# EasyEDA Pro project motoko_ice_dragon_x.eprj, board PCB1
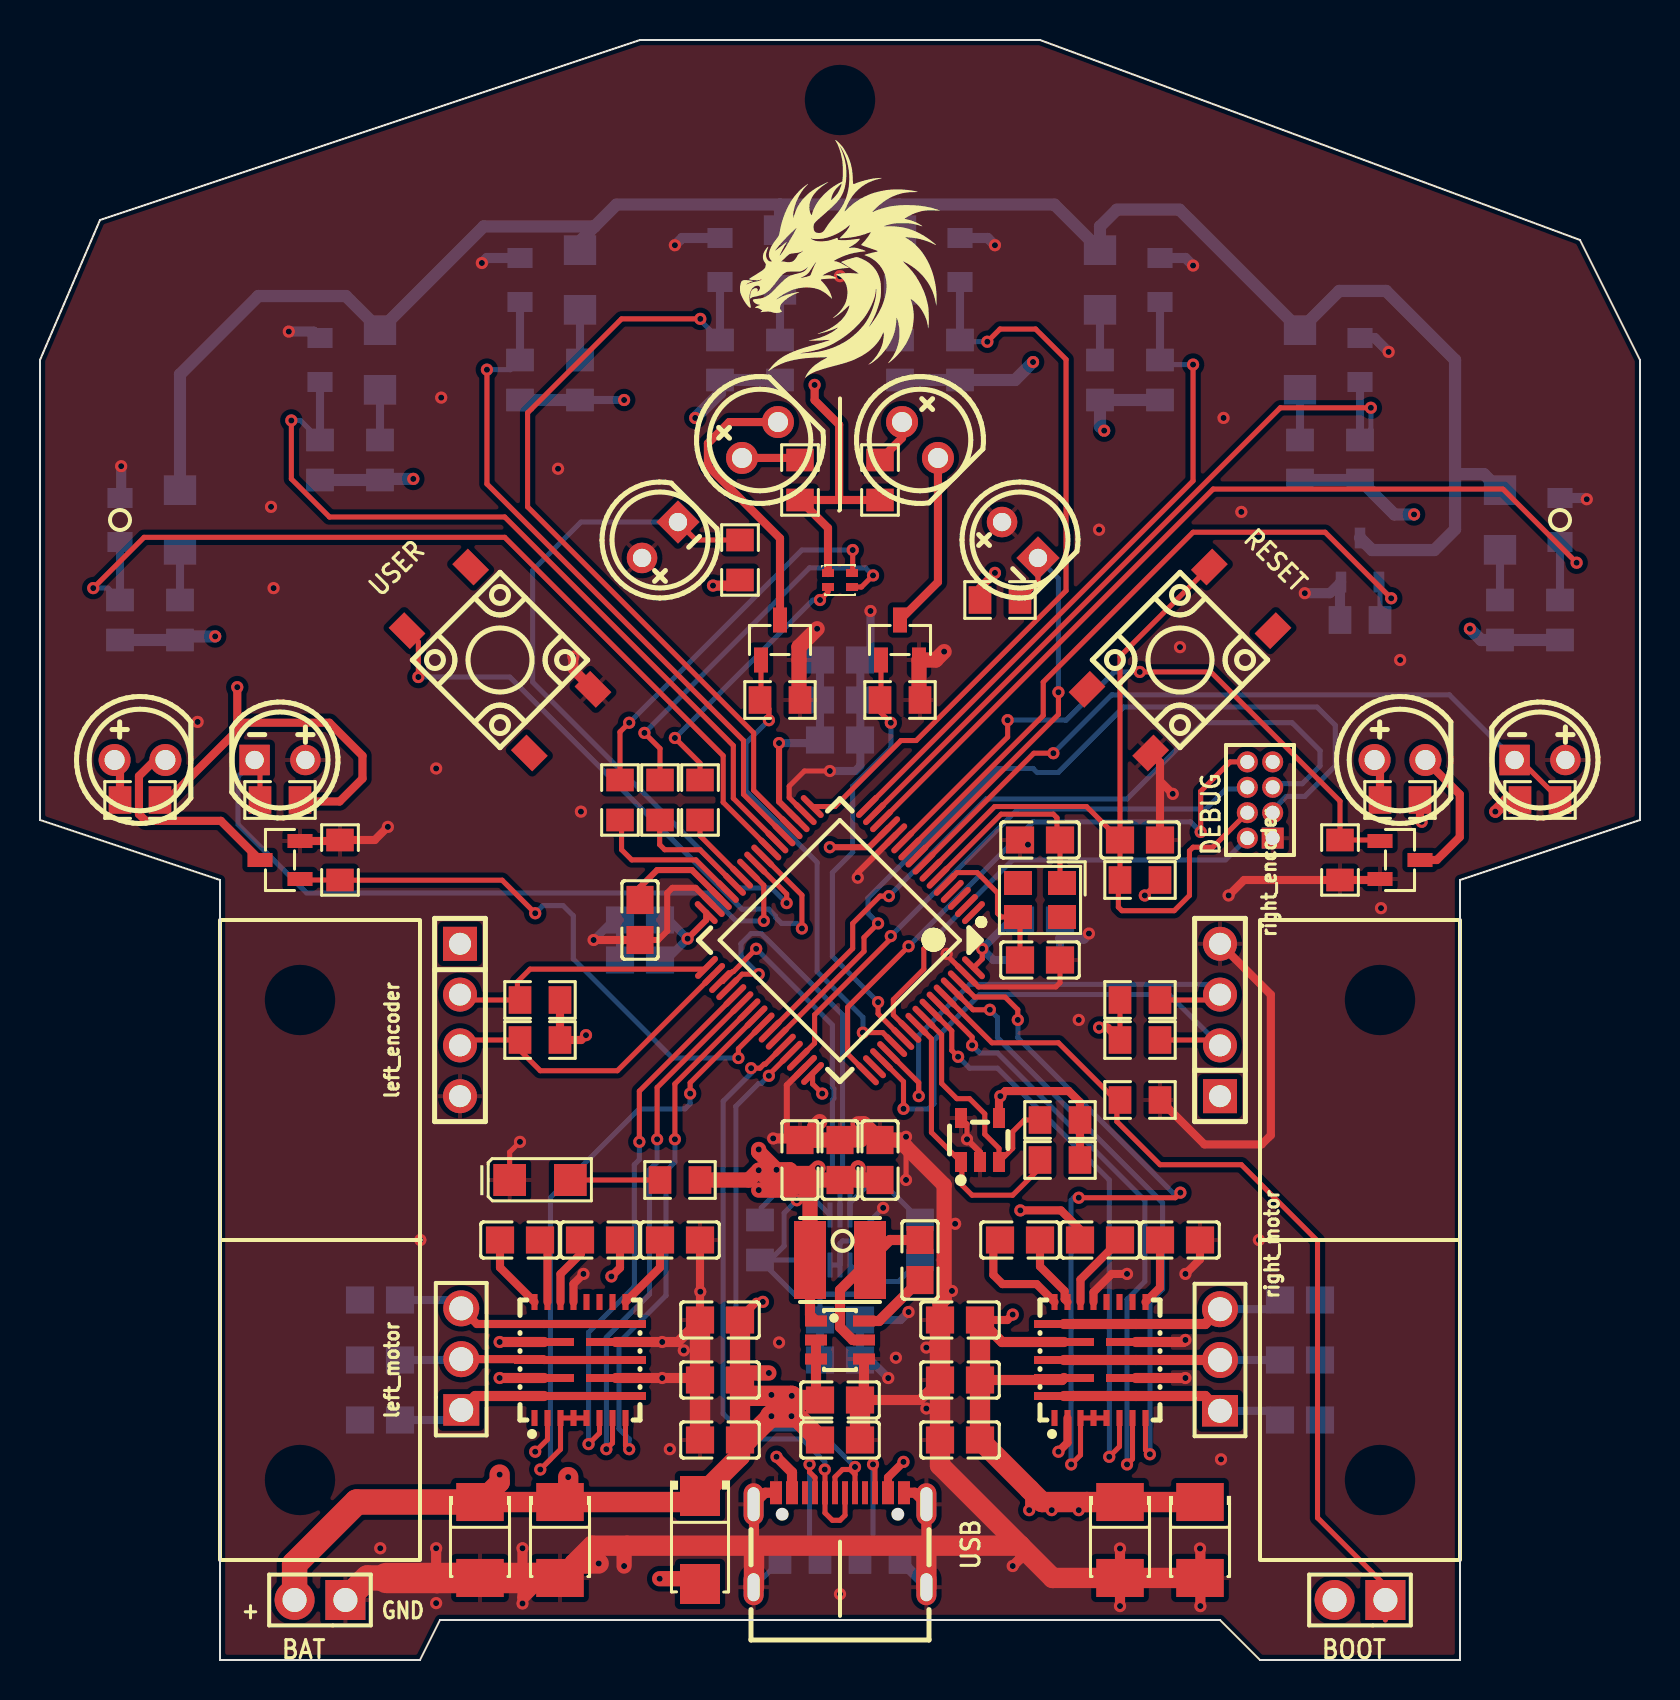
[diagram p4: board, top side]
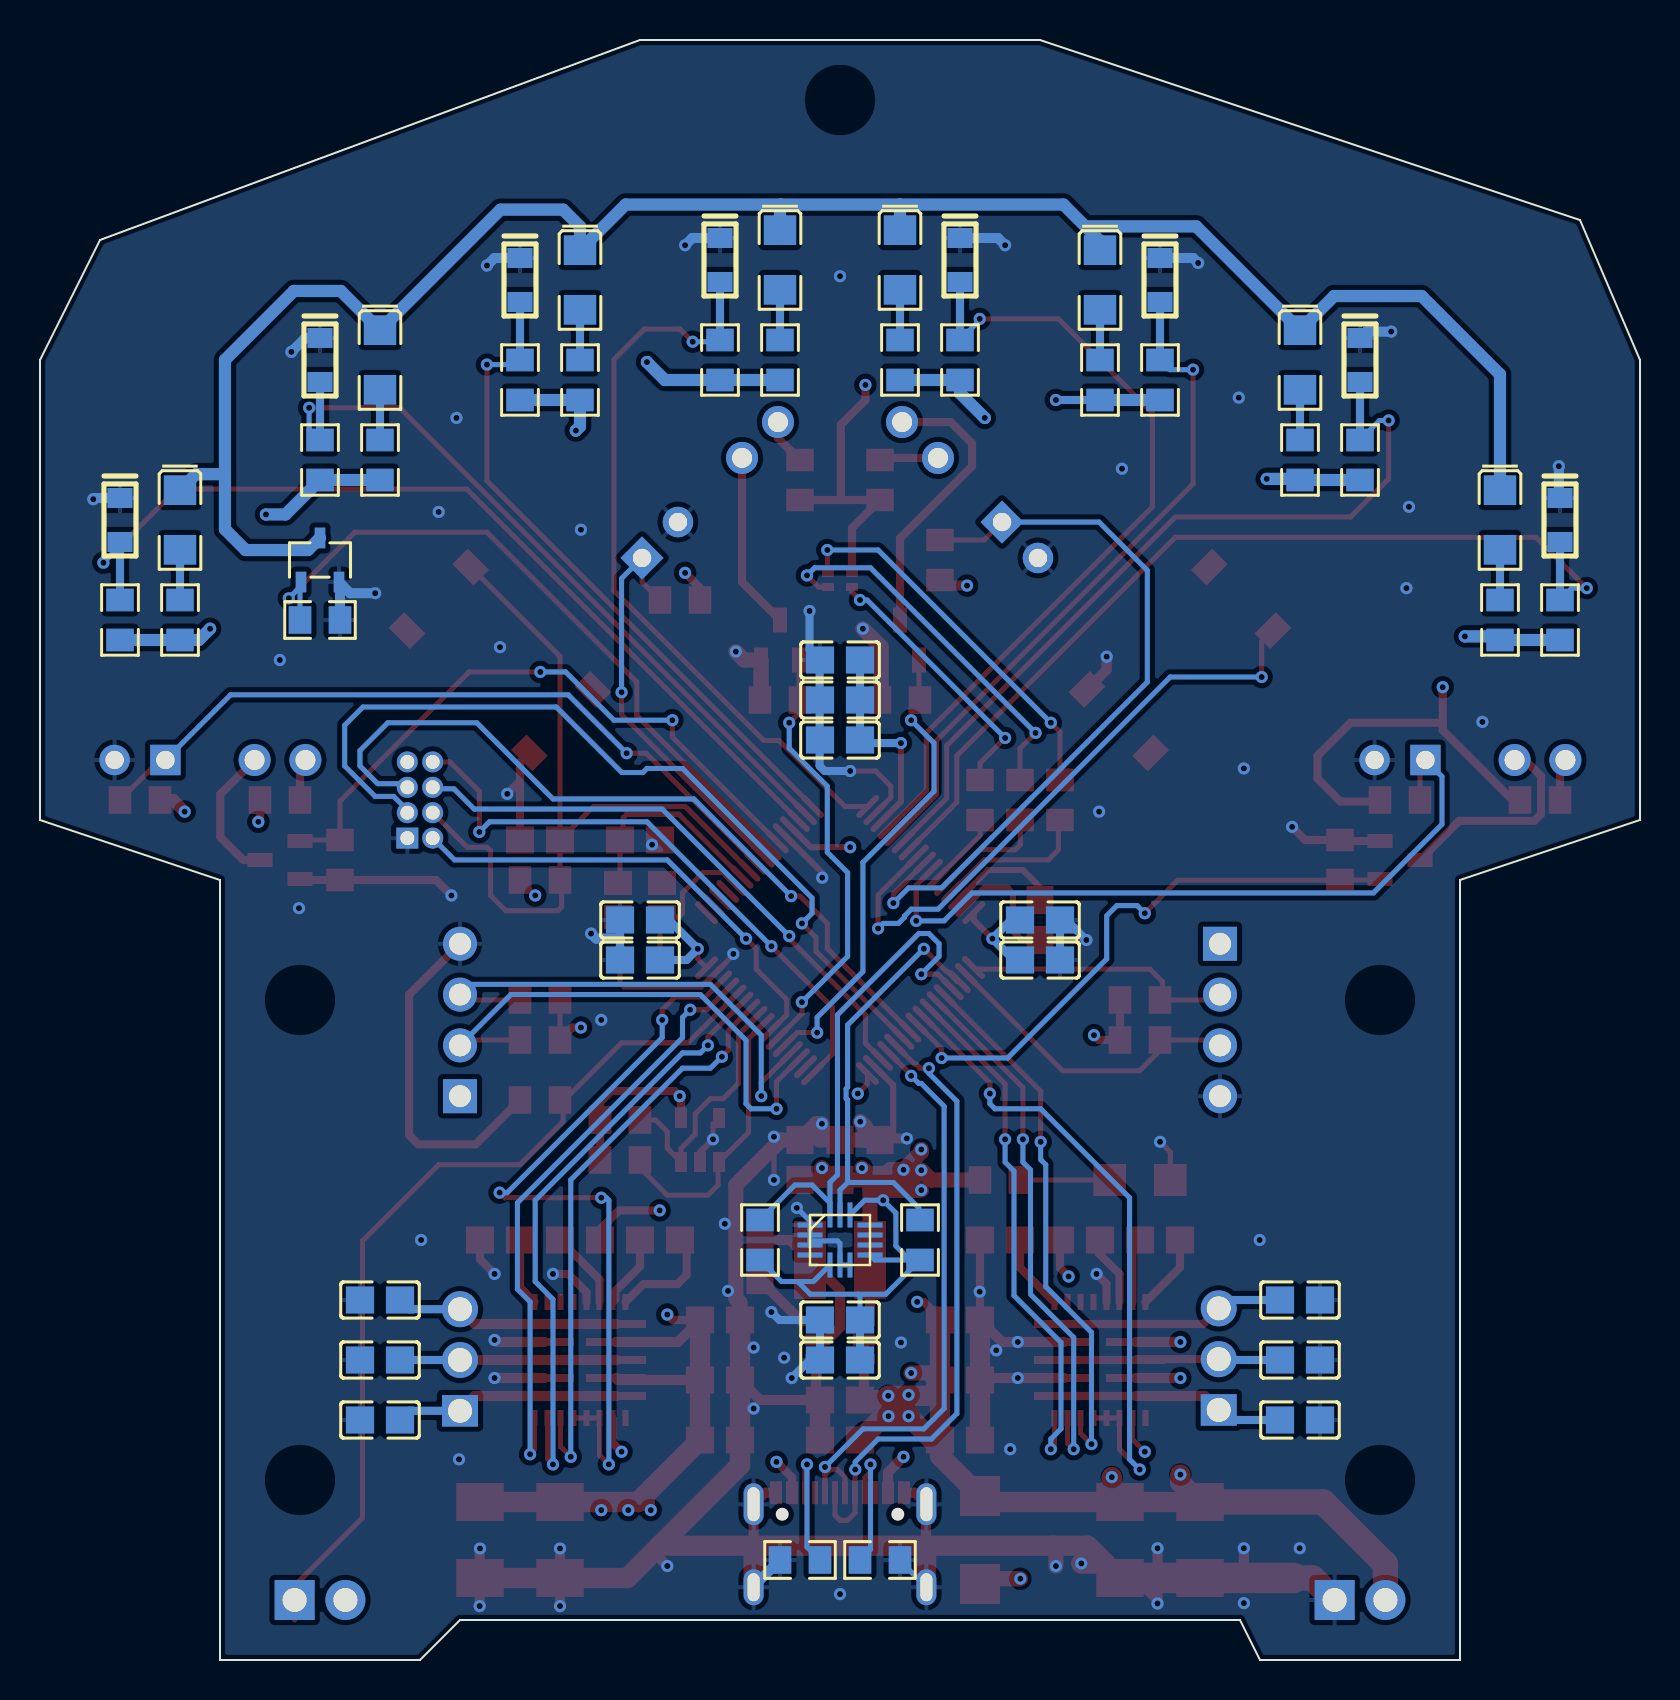
[diagram p5: board, bottom side, seen from below]

Outline 80 x 81 mm; copper layers: Top Layer, Inner1, Inner2, Bottom Layer. Coordinates in mm from the lower left corner of the outline.
Outline path: 0,65 0,42 9,39 9,0 19,0 20,2 59,2 61,0 71,0 71,39 80,42 80,65 77,71 50,81 30,81 3,72 0,65
Stack: Top Layer 0.035mm Outer layer thickness 1oz / Dielectric1 0.2104mm 7628 RC49% 8.6mil / Inner1 0.0152mm Inner layer thickness / Dielectric2 1.065mm 1.1mm H/HOZ Copper / Inner2 0.0152mm Inner layer thickness / Dielectric3 0.2104mm 7628 RC49% 8.6mil / Bottom Layer 0.035mm Outer layer thickness 1oz

## Design rules (mm)
template: JLCPCB Capability(Two Layers Board)
spacing copperThickness1oz (default): track to track 0.102, other pairs 0.152 to 0.3
spacing copperThickness2oz: track to track 0.203, other pairs 0.152 to 0.3
track width copperThickness1oz (default): min 0.127, default 0.254, max 2.54
track width copperThickness2oz: min 0.203, default 0.254, max 2.54
differential pair differentialPair (default): width min 0.127, default 0.254, max 2.54; gap min 0.152, default 0.152
via viaSize (default): diameter min 0.5, default 0.61, max 10; hole min 0.3, default 0.305, max 6.3

## Placement (name value [footprint] x y rotation side)
BAT  PZ254V-11-02P  [HDR-TH_2P-P2.54-V-M]  14 3 180 top
BOOT  PZ254V-11-02P  [HDR-TH_2P-P2.54-V-M]  66 3 180 top
C1  100nF  [C0805]  40 50 180 bottom
C2  100nF  [C0805]  40 46 180 bottom
C3  100nF  [C0805]  50 35 180 bottom
C4  100nF  [C0805]  30 35 0 bottom
C5  100nF  [C0805]  40 48 180 bottom
C6  10uF  [C0805]  50 37 180 bottom
C7  10uF  [C0805]  30 37 0 bottom
C8  2.2uF  [C0805]  30 37 270 top
C9  100nF  [C0805]  55 41 180 top
C11  100nF  [C0805]  34 11 0 top
C12  10uF  [C0805]  34 14 0 top
C13  100nF  [C0805]  24 21 0 top
C14  4.7uF  [C0805]  32 21 180 top
C15  1uF  [C0805]  28 21 180 top
C16  10uF  [C0805]  34 17 0 top
C17  100nF  [C0805]  46 17 0 top
C18  10uF  [C0805]  46 14 0 top
C19  100nF  [C0805]  49 21 0 top
C20  4.7uF  [C0805]  57 21 180 top
C21  1uF  [C0805]  53 21 0 top
C22  10uF  [C0805]  46 11 0 top
C62  100n  [C0805]  44 20 270 top
C63  100nF  [C0805]  40 25 270 top
C64  10uF  [C0805]  38 25 270 top
C65  10uF  [C0805]  42 25 270 top
C66  100nF  [C0805]  40 13 180 top
C67  10uF  [C0805]  40 11 180 top
C72  100nF  [C0805]  40 15 180 bottom
C73  100nF  [C0805]  40 17 180 bottom
C74  47uF  [CAP-SMD_L3.5-W2.8-R-RD]  26 6 90 top
C75  47uF  [CAP-SMD_L3.5-W2.8-R-RD]  22 6 90 top
C82  18p  [C0805]  50 35 180 top
C83  18p  [C0805]  50 41 0 top
C84  47uF  [CAP-SMD_L3.5-W2.8-R-RD]  54 6 90 top
C85  47uF  [CAP-SMD_L3.5-W2.8-R-RD]  58 6 90 top
C86  120p  [C0805]  17 12 0 bottom
C87  120p  [C0805]  17 15 0 bottom
C88  120p  [C0805]  17 18 0 bottom
C89  120p  [C0805]  63 12 180 bottom
C90  120p  [C0805]  63 15 180 bottom
C91  120p  [C0805]  63 18 180 bottom
D1  SS34  [SMA_L4.3-W2.6-LS5.2-RD]  33 6 270 top
DEBUG  PH-00742  [HDR-TH_8P-P1.27-V-M-R2-C4-S1.27]  61 43 90 top
L1  4.7uH  [IND-SMD_L4.0-W4.0_FNR40XXS]  40 20 180 top
LED1  CLMUD-FKC-CH1NP1561BB7T4S3  [LED-SMD_4P-L1.5-W1.5_CLMUD-FKC-CH1NP1561BB7T4S3]  40 54 0 top
LED2  YLED1206G  [LED1206-RD]  25 24 0 top
LED3  YLED1206W  [LED1206-R-RD]  73 57 270 bottom
LED4  YLED1206W  [LED1206-R-RD]  63 65 270 bottom
LED5  YLED1206W  [LED1206-R-RD]  53 69 270 bottom
LED6  YLED1206W  [LED1206-R-RD]  7 57 270 bottom
LED7  YLED1206W  [LED1206-R-RD]  37 70 270 bottom
LED8  YLED1206W  [LED1206-R-RD]  27 69 270 bottom
LED9  YLED1206W  [LED1206-R-RD]  43 70 270 bottom
LED10  YLED1206W  [LED1206-R-RD]  17 65 270 bottom
LED11  HSDL-4250  [LED-TH_BD5.0-P2.54-FD-1]  5 45 0 top
LED12  HSDL-4250  [LED-TH_BD5.0-P2.54-FD-1]  36 61 45 top
LED13  HSDL-4250  [LED-TH_BD5.0-P2.54-FD-1]  44 61 315 top
LED14  HSDL-4250  [LED-TH_BD5.0-P2.54-FD-1]  68 45 0 top
left_encoder  PZ254V-11-04P  [HDR-TH_4P-P2.54-V-M]  21 32 270 top
left_motor  2.54-1*3P针  [HDR-TH_3P-P2.54-V-M-1]  21.06 15.04 90 top
Q1  BSS123  [SOT-23-3_L3.0-W1.7-P0.95-LS2.9-BR]  66 55 270 bottom
Q2  BSS138  [SOT-23-3_L2.9-W1.3-P1.90-LS2.4-BR_1]  12 40 0 top
Q3  BSS138  [SOT-23-3_L2.9-W1.3-P1.90-LS2.4-BR_1]  37 51 270 top
Q4  BSS138  [SOT-23-3_L2.9-W1.3-P1.90-LS2.4-BR_1]  43 51 270 top
Q5  BSS138  [SOT-23-3_L2.9-W1.3-P1.90-LS2.4-BR_1]  68 40 180 top
R1  4.7kΩ  [R0805]  55 39 0 top
R2  4.7kΩ  [R0805]  55 28 0 top
R4  4.7kΩ  [R0805]  33 43 270 top
R5  4.7kΩ  [R0805]  31 43 270 top
R6  4.7kΩ  [R0805]  29 43 270 top
R7  4.7kΩ  [R0805]  25 33 0 top
R8  4.7kΩ  [R0805]  25 31 0 top
R9  4.7kΩ  [R0805]  55 31 180 top
R10  4.7kΩ  [R0805]  55 33 180 top
R11  4.7kΩ  [R0805]  44 21 270 bottom
R12  4.7kΩ  [R0805]  36 21 270 bottom
R13  4.7kΩ  [R0805]  66 52 0 bottom
R14  330Ω  [R0805]  73 52 270 bottom
R15  330Ω  [R0805]  63 60 270 bottom
R16  330Ω  [R0805]  53 64 270 bottom
R17  330Ω  [R0805]  7 52 270 bottom
R18  330Ω  [R0805]  37 65 270 bottom
R19  4.7kΩ  [R0805]  35 55 270 top
R20  4.7kΩ  [R0805]  48 53 180 top
R21  4.7kΩ  [R0805]  75 43 180 top
R22  22Ω  [R0805]  5 43 0 top
R23  22Ω  [R0805]  38 59 270 top
R24  22Ω  [R0805]  42 59 270 top
R25  22Ω  [R0805]  68 43 0 top
R26  330Ω  [R0805]  27 64 270 bottom
R27  330Ω  [R0805]  43 65 270 bottom
R28  330Ω  [R0805]  17 60 270 bottom
R29  330Ω  [R0805]  32 24 0 top
R30  4.7kΩ  [R0805]  42 5 0 bottom
R31  4.7kΩ  [R0805]  38 5 180 bottom
R38  4.7kΩ  [R0805]  76 52 270 bottom
R39  4.7kΩ  [R0805]  66 60 270 bottom
R40  4.7kΩ  [R0805]  56 64 270 bottom
R41  4.7kΩ  [R0805]  46 65 270 bottom
R42  4.7kΩ  [R0805]  34 65 270 bottom
R43  4.7kΩ  [R0805]  24 64 270 bottom
R44  4.7kΩ  [R0805]  14 60 270 bottom
R45  4.7kΩ  [R0805]  4 52 270 bottom
R48  4.7kΩ  [R0805]  12 43 0 top
R51  4.7kΩ  [R0805]  51 25 180 top
R52  4.7kΩ  [R0805]  51 27 180 top
R53  4.7kΩ  [R0805]  15 40 90 top
R55  4.7kΩ  [R0805]  37 48 0 top
R57  4.7kΩ  [R0805]  43 48 0 top
R59  4.7kΩ  [R0805]  65 40 270 top
RESET  TS1705-TZ60HBS  [SW-SMD_4P-L6.2-W6.2-P4.50-LS9.2-2]  57 50 45 top
right_encoder  PZ254V-11-04P  [HDR-TH_4P-P2.54-V-M]  59 32 90 top
right_motor  2.54-1*3P针  [HDR-TH_3P-P2.54-V-M-1]  59 15 90 top
S1  SFH3710-Z  [OPTO-SMD_SFH3710-Z]  76 57 270 bottom
S2  SFH3710-Z  [OPTO-SMD_SFH3710-Z]  66 65 270 bottom
S3  SFH3710-Z  [OPTO-SMD_SFH3710-Z]  56 69 270 bottom
S4  SFH3710-Z  [OPTO-SMD_SFH3710-Z]  46 70 270 bottom
S5  SFH3710-Z  [OPTO-SMD_SFH3710-Z]  34 70 270 bottom
S6  SFH3710-Z  [OPTO-SMD_SFH3710-Z]  24 69 270 bottom
S7  SFH3710-Z  [OPTO-SMD_SFH3710-Z]  14 65 270 bottom
S8  SFH3710-Z  [OPTO-SMD_SFH3710-Z]  4 57 270 bottom
S9  SFH 313FA  [OPTO-TH_BD5.7-P2.54-D0.8]  12 45 0 top
S10  SFH 313FA  [OPTO-TH_BD5.7-P2.54-D0.8]  31 56 225 top
S11  SFH 313FA  [OPTO-TH_BD5.7-P2.54-D0.8]  49 56 135 top
S12  SFH 313FA  [OPTO-TH_BD5.7-P2.54-D0.8]  75 45 0 top
U1  STM32F722RET6TR  [LQFP-64_L10.0-W10.0-P0.50-LS12.0-BL]  40 36 135 top
U4  LSM6DSM  [LGA14L]  40 21 180 bottom
U10  MP6541GQKT-Z  [QFN-26_L6.0-W6.0-P0.65-TL_MP6541]  27 15 90 top
U11  MP6541GQKT-Z  [QFN-26_L6.0-W6.0-P0.65-TL_MP6541]  53 15 90 top
U12  AP63203WU-7  [TSOT-26_L2.9-W1.6-P0.95-LS2.8-BL]  40 16 270 top
U14  24CS256T-E/OT  [SOT-23-5_L2.9-W1.6-P0.95-LS2.8-BR]  47 26 270 top
USB  TYPE-C16PIN  [USB-C-SMD_TYPE-C16PIN]  40 6 0 top
USER  TS1705-TZ60HBS  [SW-SMD_4P-L6.2-W6.2-P4.50-LS9.2-2]  23 50 135 top
X1  8MHz  [CRYSTAL-SMD_4P-L3.2-W2.5-BL]  50 38 180 top

## Footprints (pads in the part's own frame, mm; a bottom-side part is the same pattern mirrored in y, then rotated)
C0805
  rect 1.41x1.35 smd: 1(-1,0) 2(1,0)
CAP-SMD_L3.5-W2.8-R-RD
  rect 1.9x2.376 smd: 1(1.899,0) 2(-1.899,0)
CRYSTAL-SMD_4P-L3.2-W2.5-BL
  rect 1.4x1.2 smd: 1(-1.1,-0.85) 2(1.1,-0.85) 3(1.1,0.85) 4(-1.1,0.85)
HDR-TH_2P-P2.54-V-M
  rect 2x2 hole 1.2: 1(-1.27,0)
  round 2 hole 1.2: 2(1.27,0)
HDR-TH_3P-P2.54-V-M-1
  rect 1.575x1.8 hole 1.2: 1(-2.54,0)
  round 1.8 hole 1.2: 2(0,0) 3(2.54,0)
HDR-TH_4P-P2.54-V-M
  rect 1.7x1.7 hole 1.1: 1(-3.81,0)
  round 1.7 hole 1.1: 2(-1.27,0) 3(1.27,0) 4(3.81,0)
HDR-TH_8P-P1.27-V-M-R2-C4-S1.27
  rect 1.05x1.1 hole 0.7: 1(-1.905,-0.635)
  round 1.05 hole 0.7: 2(-1.905,0.635) 3(-0.635,-0.635) 4(-0.635,0.635) 5(0.635,-0.635) 6(0.635,0.635) 7(1.905,-0.635) 8(1.905,0.635)
IND-SMD_L4.0-W4.0_FNR40XXS
  rect 1.6x3.9 smd: 1(-1.5,0) 2(1.5,0)
LED1206-R-RD
  rect 1.485x1.62 smd: 1(1.492,0) 2(-1.492,0)
LED1206-RD
  rect 1.635x1.6 smd: 1(-1.518,0) 2(1.518,0)
LED-SMD_4P-L1.5-W1.5_CLMUD-FKC-CH1NP1561BB7T4S3
  rect 0.6x0.4 smd: 1(-0.6,0.35) 2(-0.6,-0.35) 3(0.6,-0.35) 4(0.6,0.35)
LED-TH_BD5.0-P2.54-FD-1
  round 1.6 hole 1: 1(-1.27,0) 2(1.27,0)
LGA14L
  rect 1.25x0.25 smd: P$1(-1.5,0.75) P$2(-1.5,0.25) P$3(-1.5,-0.25) P$4(-1.5,-0.75) P$8(1.5,-0.75) P$9(1.5,-0.25) P$10(1.5,0.25) P$11(1.5,0.75)
  rect 0.25x1.25 smd: P$5(-0.5,-1.25) P$6(0,-1.25) P$7(0.5,-1.25) P$12(0.5,1.25) P$13(0,1.25) P$14(-0.5,1.25)
LQFP-64_L10.0-W10.0-P0.50-LS12.0-BL
  oval 0.3x1.5 smd: 1(-3.75,-5.688) 2(-3.25,-5.688) 3(-2.75,-5.688) 4(-2.25,-5.688) 5(-1.75,-5.688) 6(-1.25,-5.688) 7(-0.75,-5.688) 8(-0.25,-5.688) 9(0.25,-5.688) 10(0.75,-5.688) 11(1.25,-5.688) 12(1.75,-5.688) 13(2.25,-5.688) 14(2.75,-5.688) 15(3.25,-5.688) 16(3.75,-5.688) 33(3.75,5.688) 34(3.25,5.688) 35(2.75,5.688) 36(2.25,5.688) 37(1.75,5.688) 38(1.25,5.688) 39(0.75,5.688) 40(0.25,5.688) 41(-0.25,5.688) 42(-0.75,5.688) 43(-1.25,5.688) 44(-1.75,5.688) 45(-2.25,5.688) 46(-2.75,5.688) 47(-3.25,5.688) 48(-3.75,5.688)
  oval 1.5x0.3 smd: 17(5.7,-3.738) 18(5.7,-3.238) 19(5.7,-2.738) 20(5.7,-2.238) 21(5.7,-1.738) 22(5.7,-1.238) 23(5.7,-0.739) 24(5.7,-0.238) 25(5.7,0.262) 26(5.7,0.762) 27(5.7,1.262) 28(5.7,1.762) 29(5.7,2.261) 30(5.7,2.762) 31(5.7,3.261) 32(5.7,3.762) 49(-5.7,3.762) 50(-5.7,3.261) 51(-5.7,2.762) 52(-5.7,2.261) 53(-5.7,1.762) 54(-5.7,1.262) 55(-5.7,0.762) 56(-5.7,0.262) 57(-5.7,-0.238) 58(-5.7,-0.739) 59(-5.7,-1.238) 60(-5.7,-1.738) 61(-5.7,-2.238) 62(-5.7,-2.738) 63(-5.7,-3.238) 64(-5.7,-3.738)
OPTO-SMD_SFH3710-Z
  rect 1x1.25 smd: 1(-1.1,0) 2(1.1,0)
OPTO-TH_BD5.7-P2.54-D0.8
  rect 1.524x1.524 hole 0.914: 1(-1.27,0)
  round 1.524 hole 0.914: 2(1.27,0)
QFN-26_L6.0-W6.0-P0.65-TL_MP6541
  rect 0.8x0.3 smd: 1(-2.9,2.275) 2(-2.9,1.625) 3(-2.9,0.975) 4(-2.9,0.325) 5(-2.9,-0.325) 6(-2.9,-0.975) 7(-2.9,-1.625) 8(-2.9,-2.275) 14(2.9,-2.275) 15(2.9,-1.625) 16(2.9,-0.975) 17(2.9,-0.325) 18(2.9,0.325) 19(2.9,0.975) 20(2.9,1.625) 21(2.9,2.275)
  rect 0.4x3 smd: 9(-1.8,-1.8) 10(-0.9,-1.8) 11(0,-1.8) 12(0.9,-1.8) 13(1.8,-1.8) 22(1.8,1.8) 23(0.9,1.8) 24(0,1.8) 25(-0.9,1.8) 26(-1.8,1.8)
R0805
  rect 1.133x1.377 smd: 1(-1,0) 2(1,0)
SMA_L4.3-W2.6-LS5.2-RD
  rect 2x2 smd: 1(-2.2,0) 2(2.2,0)
SOT-23-3_L2.9-W1.3-P1.90-LS2.4-BR_1
  rect 1.25x0.7 smd: 1(1,-0.95) 2(1,0.95) 3(-1,0)
SOT-23-3_L3.0-W1.7-P0.95-LS2.9-BR
  rect 1.038x0.532 smd: 1(1.101,-0.95) 2(1.101,0.95) 3(-1.101,0)
SOT-23-5_L2.9-W1.6-P0.95-LS2.8-BR
  rect 1x0.6 smd: 1(1.1,-0.95) 2(1.1,0) 3(1.1,0.95) 4(-1.1,0.95) 5(-1.1,-0.95)
SW-SMD_4P-L6.2-W6.2-P4.50-LS9.2-2
  rect 1.5x1.1 smd: 1(-4.325,2.25) 2(4.325,2.25) 3(-4.325,-2.25) 4(4.325,-2.25)
TSOT-26_L2.9-W1.6-P0.95-LS2.8-BL
  rect 0.55x1.1 smd: 1(-0.95,-1.2) 2(0,-1.2) 3(0.95,-1.2) 4(0.95,1.2) 5(0,1.2) 6(-0.95,1.2)
USB-C-SMD_TYPE-C16PIN
  oval 1x2.1 hole 0.6x1.7: 1(-4.32,1.788) 2(4.32,1.788)
  oval 1x1.8 hole 0.6x1.4: 3(-4.32,-2.362) 4(4.32,-2.362)
  rect 0.6x1.15 smd: A1B12(-3.2,2.362) A4B9(-2.4,2.362) B1A12(3.2,2.362) B4A9(2.4,2.362)
  rect 0.3x1.15 smd: A5(-1.25,2.362) A6(-0.25,2.362) A7(0.25,2.362) A8(1.25,2.362) B5(1.75,2.362) B6(0.75,2.362) B7(-0.75,2.362) B8(-1.75,2.362)

## Nets
As in the schematic.

Pads without a net: RESET 1 4; U1 1 2 3 4 50; U4 P$4 P$9 P$10 P$11; U10 1 15 16 17; U11 1 15 16 17; USB A8 B8; USER 1 4; X1 2 4

## Via types
v1: diameter 0.61, hole 0.305, Top Layer to Bottom Layer, 193 vias

## Routing (per net, layer and track width the routed paths; a pad name or vN(x,y) marks a point on that pad's centre or on a via; arc(x,y) is an arc through that point)
+3V3: length 589.9
  Top Layer w0.254: R1.2 55.24,38.24 v1(55.24,38.23) ; 38.25,23.75 38.25,23.39 v1(37.84,22.99) ; U1.64 47.11,35.05 v1(47.11,35.56) ; v1(39.11,28.32) 38.63,28.8 U1.48 ; R9.2 R10.2 ; U10.2 25.38,11.03 v1(24.76,10.41)
  Top Layer w0.305: v1(39.49,40.64) 41.46,40.64 42.43,41.61 ; v1(36.95,45.85) 36.95,42.92 37.91,41.97 ; v1(32.38,36.07) 33.31,37 U1.32
  Top Layer w0.406: 9.86,46.86 14.47,46.86 16.12,45.21 16.12,44.07 14.98,42.93 13.07,42.93 R48.2 ; 9.86,46.86 9.86,46.49 6.38,43 R22.2 ; 9.86,46.86 v1(9.86,48.64) ; U14.4 47.95,28.13 v1(48.02,28.19) 48.27,28.45 51.43,28.45 52,27.88 R52.1 R51.1 ; v1(38.73,63.75) 38.73,62.99 39.96,61.76 39.96,58 ; 39.96,58 R23.2 39.4,56.6 LED1.1 ; 39.96,58 R24.2 ; R25.2 69,41.99 v1(69.08,41.91) ; v1(27.3,31.24) 27.06,31 R8.2 R7.2 ; v1(52.95,31.62) 53.38,31.62 R9.2 ; R20.2 47,53.61 v1(47.75,54.36) ; U11.2 51.38,10.87 v1(50.92,10.41)
  Top Layer w0.508: U12.1 38.5,17.25 L1.2 ; 38.25,23.75 38.25,23.94 38.31,24 38.77,24.46 ; v1(33.65,53.72) 34.72,53.72 R19.2
  Top Layer w0.61: R21.2 73.35,43 v1(72.77,42.42)
  Top Layer w0.762: C64.2 37.5,23.5 v1(35.94,23.5) ; C64.2 36.43,24 v1(35.94,24.49) 35.45,24 R29.2 ; C64.2 38.77,24 ; C64.2 37.49,24.51 v1(36.82,24.51) 35.94,25.4 v1(35.94,25.53) ; 38.77,24 38.77,24.46 v1(38.9,24.6) ; 38.77,24 C63.2 ; v1(40.9,24.6) 40.9,24.6 40.9,24 ; 40.31,24 40.9,24 ; 40.9,24 C65.2 ; L1.2 38.5,23.5 38.25,23.75
  Inner2 w0.254: v1(39.11,28.32) 39.49,27.94
  Inner2 w0.305: BOOT.2 64.73,3.27 59.11,8.89 50.69,8.89 49.17,10.41
  Inner2 w0.406: 52.51,29.08 52.95,29.52 v1(52.95,31.62) ; v1(24.76,10.41) 19.43,10.41 18.92,10.92 18.92,17.78 22.35,21.21 38.22,21.21 40.9,23.89 v1(40.9,24.6) ; 37.16,58.12 37.16,57.23 v1(33.65,53.72) ; 29.59,61.72 29.21,62.11 v1(29.21,63) ; 39.49,32.39 36.05,32.39 v1(32.38,36.07) ; 10.57,51.18 9.86,50.47 v1(9.86,48.64) ; v1(48.02,28.19) 48.13,28.19 49.02,29.08 ; v1(47.75,54.36) 46.48,55.63 46.48,59.29 49.98,62.79 ; 44.19,25.02 45.56,23.65 45.56,23.6 46.6,22.56 46.6,12.98 49.17,10.41 v1(50.92,10.41) ; v1(38.73,63.75) 38.73,64.59 38.68,64.64 ; 49.97,29.08 49.97,31.94 55.24,37.21 v1(55.24,38.23)
  Inner2 w0.508: 41.32,25.02 v1(40.9,24.6) ; 26.03,29.97 26.03,33.15 23.37,35.81 left_encoder.1 ; 26.03,29.97 26.03,27.37 28.89,24.51 ; 26.03,29.97 v1(27.3,31.24) ; v1(36.95,45.85) 36.95,42.48 39.49,39.94 ; v1(47.11,35.56) 44.29,32.74 44.29,29.08
  Inner2 w0.61: 69.97,57.26 69.97,49.54 71.5,48.02 ; 69.97,57.26 69.95,57.28 v1(68.7,57.28) ; 69.97,57.26 69.97,57.91 67.56,60.33 53.34,60.33 ; 71.5,43.69 69.72,41.91 v1(69.08,41.91) ; 71.5,43.69 v1(72.77,42.42) ; 71.5,43.69 71.5,48.02 ; 53.34,60.33 53.34,61.34 v1(53.21,61.47) ; 53.34,60.33 52.45,60.33 49.59,63.19 ; v1(32.76,62.1) 32.13,62.74 32.13,63.25 ; 19.74,60.13 19.74,57.21 13.71,51.18 v1(8.76,51.18) ; 19.74,60.13 v1(18.66,59.06) ; 19.74,60.13 21.33,61.72 30.35,61.72 33.27,64.64 48.13,64.64 49.59,63.19 ; v1(49.65,64.9) 49.65,63.25 49.59,63.19 ; 71.5,48.02 v1(71.5,51.56)
  Inner2 w0.762: v1(37.84,22.99) 37.33,23.5 v1(35.94,23.5) 35.73,23.5 34.71,24.51 ; v1(38.9,24.6) 38.9,25.02 ; 39.88,25.02 39.88,27.55 39.49,27.94 v1(39.49,40.64) ; 39.88,25.02 36.44,25.02 v1(35.94,25.53) 34.92,24.51 ; 39.88,25.02 42.1,25.02 ; 48.76,29.08 53.08,29.08 54.73,27.43 58.24,27.43 right_encoder.1 ; 48.76,29.08 48.02,28.34 v1(48.02,28.19) ; 48.76,29.08 43.05,29.08 42.03,28.07 42.03,25.09 42.1,25.02 ; 42.1,25.02 46.36,25.02 47.12,24.26 58.92,24.26 63.5,28.83 63.5,44.2 62.79,44.91 DEBUG.7 ; 34.92,24.51 35.91,24.51 v1(35.94,24.49) 35.96,24.51 v1(36.82,24.51) ; 34.92,24.51 34.71,24.51 ; 34.71,24.51 30.73,28.49 30.73,31.11 26.28,35.56 26.28,38.86 24.12,41.02 24.12,55.12 29.08,60.07 31.36,60.07 33.52,57.91 36.95,57.91 40.56,61.52 40.56,64.64 ; 34.71,24.51 28.89,24.51
  Bottom Layer w0.254: C73.2 39,18.17 39.12,18.29 ; 39.12,18.29 37.71,18.29 R12.2 36.5,20 ; 39.12,18.29 41.48,18.29 42.12,18.92 ; U4.P$12 38.76,22.99 v1(37.84,22.99) 37.21,22.35 37.21,20.7 36.5,20 ; U4.P$8 38.25,20 36.5,20 ; 42.12,18.92 42.92,18.92 R11.2 ; 42.12,18.92 41.33,18.92 U4.P$5
  Bottom Layer w0.406: C4.2 31.31,35 v1(32.38,36.07) 31.45,37 C7.2 ; C3.2 47.67,35 v1(47.11,35.56) 48.55,37 C6.2 ; C73.2 C72.2 ; C1.2 C5.2 C2.2 38.85,45.85 v1(36.95,45.85) ; R26.2 v1(29.21,63)
  Bottom Layer w0.61: v1(71.5,51.56) 72.06,51 R14.2 R38.2 ; R43.2 R26.2 ; R15.2 R39.2 67.72,57.28 v1(68.7,57.28) ; R44.2 R28.2 17.06,59.06 v1(18.66,59.06) ; R40.2 R16.2 53,61.68 v1(53.21,61.47) ; R18.2 R42.2 34,63.34 v1(32.76,62.1) ; R45.2 R17.2 7.18,51.18 v1(8.76,51.18) ; R27.2 R41.2 48.75,64 v1(49.65,64.9)
GND: length 710.6
  Top Layer w0.254: v1(43.3,24) v1(43.3,26.16) ; v1(49.4,40.77) 49.23,40.77 C83.1 ; C82.1 51,33.86 50.79,33.66 46.92,33.66 U1.63 45.33,35.25 v1(45.33,35.31) ; v1(39.49,44.45) 38.22,44.45 37.46,43.69 37.46,43.12 U1.18 ; v1(24.12,2.83) 25.4,4.1 ; 19.81,4.16 19.86,4.1 ; v1(44.32,15.62) 45,16.3 ; v1(46.35,26.03) 46.35,26.8 U14.5 ; 24.12,4.23 23.99,4.1 ; v1(24,25.91) 23.48,25.39 LED2.1
  Top Layer w0.305: v1(46.35,26.03) 47,25.39 U14.2 ; C8.2 30.91,36 31.36,36.45 31.36,38.35 31.62,38.61 32.78,38.61 U1.31 ; 37.34,26.08 37.34,28.75 U1.47 ; v1(40.89,39.12) 40.89,39.36 U1.12
  Top Layer w0.406: C14.1 C16.1 ; v1(17.39,41.66) 16.74,41 R53.2 14.95,40.95 Q2.2 ; U11.18 52.68,18.39 53.59,19.3 v1(54.35,19.3) ; v1(27.17,19.3) 26.68,18.81 U10.18 ; v1(59.43,38.23) 60.2,39 R59.2 66.95,39 Q5.2 ; 55.53,45.35 56,44.88 56,43.94 ; C20.1 58,20.03 v1(57.27,19.3) ; C8.2 v1(27.68,36) ; 56,43.94 v1(56.64,43.31) ; 56,43.94 C9.1 ; R2.2 58.22,25.78 61.08,25.78 61.54,26.24 61.54,33.27 right_encoder.4
  Top Layer w0.508: 37.34,26.08 v1(36.66,26.08) ; 24.12,3.13 v1(24.12,5.59) ; 24.12,3.13 25.09,4.1 ; 24.12,3.13 v1(24.12,2.83) ; v1(54,5.58) C84.2 v1(54,2.7) ; v1(19.81,5.59) 19.81,4.1 ; v1(58.02,2.7) 58.02,5.56 v1(58,5.58) ; C16.1 31.9,15.9 v1(31.11,15.9) U10.12 ; U11.10 v1(57.27,14.1) ; USB.B1A12 43.75,8.36 USB.2 44.32,5.72 ; 41.03,26 40.9,26.13 v1(40.9,26.81) ; U11.12 57.17,15.9 v1(57.27,16) ; U10.10 v1(31.11,14.1) 32.9,14.1 ; USB.A1B12 36.25,8.36 USB.1 35.7,7.77 35.7,5.72 ; 27.65,48.53 26.66,49.52 v1(26.66,50.17) ; 49.02,5.72 49.02,5.08 v1(48.64,4.7) ; C18.1 44,13 C66.1 41.2,13.2 U12.4
  Top Layer w0.762: v1(38.86,51.56) 37.95,50.66 Q3.2 37.95,48.05 R55.2 ; 29.35,5.72 29.21,5.57 v1(29.21,4.7) ; 38.75,26 C63.1 41.03,26 ; 38.75,26 C64.1 ; 38.75,26 38.75,26.68 v1(38.99,26.92) ; R57.2 43.95,48.05 Q4.2 44.79,50 v1(45.21,50.42) ; v1(40.9,26.81) 41.19,26.81 C65.1 42.96,26 45.21,23.75 45.21,18.07 45,17.87 C17.1
  Top Layer w1.016: 44.32,5.72 49.02,5.72 ; 49.02,5.72 45,9.73 C22.1 C18.1 C17.1 ; 49.02,5.72 50.63,4.1 C84.2 C85.2 ; 35.7,5.72 35.7,3.66 USB.3 ; 35.7,5.72 27.61,5.72 26.72,4.83 v1(27.94,4.83) ; 35.7,5.72 44.3,5.72 44.32,5.69 USB.4 ; C12.1 C11.1 ; C16.1 33,14.2 32.9,14.1 ; C67.1 C66.1
  Top Layer w1.27: BAT.1 16.37,4.1 17.33,4.1
  Top Layer w1.524: 25.09,4.1 C75.2 17.33,4.1
  Inner1 w0.254: v1(45.33,35.31) 49.4,39.37 v1(49.4,40.77) ; v1(43.3,26.16) 43.43,26.03 v1(46.35,26.03) ; v1(44.32,15.62) v1(44.32,12.57) ; 23.95,26.92 24,26.87 v1(24,25.91) ; 52.96,35.81 v1(52.45,36.32) ; 45.6,16.17 45.77,16
  Inner1 w0.406: v1(56.64,43.31) 56.64,40.51 56.26,40.13 ; v1(27.17,19.3) 27.17,16.76 28.44,15.49 32.18,15.49 v1(32.19,15.48) ; 56.26,40.13 55.01,38.89 54.97,38.89 54.58,38.5 54.58,38.46 v1(52.45,36.32) ; 56.26,40.13 56.47,39.91 ; 56.47,39.91 60.45,39.91 DEBUG.1 ; 56.47,39.91 58.16,38.23 v1(59.43,38.23) ; v1(57.27,19.3) v1(54.35,19.3) 53.08,18.03 53.08,16.26 ; 15.64,47.37 17.39,45.61 v1(17.39,41.66)
  Inner1 w0.508: v1(43.3,24) 43.3,23.75 v1(42.16,22.61) ; 51.93,35.81 49.91,33.78 46.86,33.78 v1(45.33,35.31) ; 51.93,35.81 v1(52.45,36.32) ; 51.93,35.81 right_encoder.4 ; 26.77,51.56 26.66,51.45 v1(26.66,50.17) ; 31.69,71.97 31.75,71.92 v1(31.75,70.74) ; v1(44.32,12.57) 44.32,12.57 USB.2 ; v1(44.32,12.57) 43.94,12.57 v1(42.41,14.1) ; v1(44.32,12.57) 42.67,10.92 33.82,10.92 32.63,12.1 32.25,12.1 31.11,13.25 ; v1(47.75,70.74) 47.75,71.87 47.64,71.97 ; 12.3,65.28 12.44,65.42 v1(12.44,66.42) ; left_encoder.4 22.27,26.92 v1(38.99,26.92) 38.15,26.08 v1(36.66,26.08) ; v1(22.09,69.85) 22.09,65.95 ; 45.54,16 45.6,16.06 v1(45.6,18.45) ; v1(43.43,17.4) 44.32,16.51 v1(44.32,15.62) 43.81,15.11 v1(42.79,15.11) ; 63.25,51.73 63.25,53.33 v1(63.24,53.34) ; 40.89,38.62 41.65,39.38 41.65,42.29 v1(39.49,44.45)
  Inner1 w0.762: 33.64,51.56 S10.2 ; 33.64,51.56 v1(38.86,51.56) 42.77,51.56 42.93,51.73 43.43,51.73 ; 33.64,51.56 19.83,51.56 S9.2 ; v1(57.27,14.1) 45.84,14.1 v1(44.32,12.57) ; 38.64,71.97 28.15,71.97 22.98,66.8 22.94,66.8 22.09,65.95 20.23,65.95 19.55,65.28 9.65,65.28 v1(4.06,59.69) ; 38.64,71.97 55.4,71.97 v1(57.65,69.72) 61.97,65.41 v1(67.43,65.41) 69.97,65.41 v1(77.34,58.04) ; 38.64,71.97 40.25,70.36 40.25,58.55 43.43,55.37 43.43,52.22 ; S11.2 43.43,52.22 ; 43.43,52.22 43.43,51.73 ; v1(19.81,2.84) 19.65,3 BAT.1 ; 15.23,1.02 15.27,1.05 BAT.1 ; BAT.1 15.27,4.86 16,5.59 v1(17.01,5.59) ; 45.24,51.73 45.21,51.7 v1(45.21,50.42) ; 45.24,51.73 43.43,51.73 ; 45.24,51.73 69.54,51.73 S12.2 ; 40.89,38.14 v1(40.89,39.12) ; 40.89,38.14 39.62,36.87 39.62,34.11 ; 40.89,38.14 43.43,40.68 43.43,51.73 ; v1(29.21,4.7) 32.63,8.13 32.63,13.08 v1(42.16,22.61) 42.16,25.56 v1(40.9,26.81) ; 39.62,34.11 39.62,30.48 40.38,29.72 40.38,27.33 v1(40.9,26.81) ; 39.62,34.11 44.14,34.11 v1(45.33,35.31) ; v1(40.9,26.81) 39.1,26.81 v1(38.99,26.92) ; v1(44.32,15.62) 44.7,16 v1(57.27,16) ; v1(27.94,4.83) 31.11,8 v1(31.11,14.1)
  Bottom Layer w0.254: v1(42.16,22.61) 41.5,21.95 U4.P$1 U4.P$2 U4.P$3 41.29,20.96 40.13,20.96 40,20.83 U4.P$6 U4.P$7 ; R31.2 37,4.96 USB.3
  Bottom Layer w0.406: C4.1 C7.1 28.68,37 v1(27.68,36) ; C82.1 C6.1 ; v1(39.49,44.45) 40.76,44.45 41.02,44.7 41.02,49.98 C1.1 41.52,50.52 v1(41.52,52.45) ; v1(42.41,14.1) 41.51,15 C72.1 C73.1 43.03,17 v1(43.43,17.4)
  Bottom Layer w0.508: v1(12.44,66.42) 13.68,66.42 S7.1 ; S8.1 4.06,58.16 v1(4.06,59.69) ; v1(63.24,53.34) 64.49,53.34 65,53.85 ; 65,53.85 Q1.2 ; 65,53.85 R13.1 ; S1.1 77.28,58.1 v1(77.34,58.04) ; v1(22.09,69.85) 22.34,70.1 S6.1 ; v1(47.75,70.74) 47.39,71.1 S4.1 ; v1(67.43,65.41) 66.74,66.1 S2.1 ; v1(57.65,69.72) 57.28,70.1 S3.1 ; USB.4 44.32,3.68 R30.2 ; S5.1 32.11,71.1 v1(31.75,70.74) ; v1(52.45,36.32) 52.19,36.07 51,36.07
  vias: v1(7.88,46.91) v1(11.55,57.66) v1(11.68,53.59) v1(19.02,21) v1(19.81,44.58) v1(20.06,63.12) v1(25.9,59.56) v1(27.05,42.42) v1(31.49,10.54) v1(33.01,18.41) v1(36.95,15.88) v1(40,69.19) v1(40,3.3) v1(45.76,21.81) v1(51.94,32) v1(52.95,56.52) v1(57,50.64) v1(59.05,10.03) v1(59.18,62.1) v1(60.07,57.4) v1(60.95,21) v1(67.05,37.59) v1(68.01,50)
VBAT: length 156.9
  Top Layer w0.254: v1(51.94,7.49) 52.34,7.9
  Top Layer w0.406: C15.1 29,19.61 v1(28.57,19.18) ; 34.67,16.76 35.81,17.91 v1(36.14,17.91) ; v1(49.02,22.48) 51.05,22.48 52,21.53 C21.1 ; v1(48.64,17.27) 48.36,17 C17.2 ; v1(49.46,7.49) 49.46,8.54
  Top Layer w0.508: U12.2 U12.3 38.8,13.01 38.79,13 ; U11.23 48.1,15.9 C17.2 ; U10.25 v1(22.98,14.1) ; U11.25 51.1,14 C18.2 ; U10.23 v1(22.98,15.9)
  Top Layer w0.762: v1(36.44,14.35) 35.35,14.35 C12.2
  Top Layer w1.016: 37.59,12.83 37.59,12.41 C67.2 ; C17.2 C18.2 C22.2 50.1,7.9 C84.1 C85.1 ; C75.1 22.98,8.88 v1(22.98,9.27) ; C66.2 37.79,13 v1(37.59,13.21) 35.27,13.21 35,13.48 C11.2 ; v1(36.57,12.19) 35.38,11 C11.2 ; 22.23,7.9 C74.1 ; 26.41,7.9 26.41,7.62 ; 26.41,7.9 32.7,7.9 D1.1 35,10.2 C11.2 ; 26.41,7.9 v1(26.41,9.14) ; C12.2 C16.2
  Top Layer w1.143: v1(37.57,12.19) v1(36.57,12.19)
  Top Layer w1.27: BAT.2 12.73,4.8 15.83,7.9 C75.1 22.23,7.9
  Inner2 w0.406: v1(28.57,19.18) 30.6,17.15 34.54,17.15 35.3,17.91 v1(36.14,17.91) ; v1(48.64,17.27) 49.02,17.65 v1(49.02,22.48)
  Inner2 w0.762: v1(36.57,13.25) 36.57,14.22 v1(36.44,14.35) 35.35,13.26 29.41,13.26 26.77,15.9 v1(22.98,15.9) ; v1(22.98,14.1) 26.66,14.1 28.95,11.81 36.19,11.81 v1(36.57,12.19)
  Inner2 w1.016: v1(37.59,13.21) 37.59,12.2 v1(37.57,12.19) ; v1(37.57,12.19) 43.05,12.19 47.75,7.49 v1(49.46,7.49) v1(50.59,7.49) v1(51.94,7.49) ; v1(37.57,12.19) v1(36.57,12.19) v1(36.57,13.25)
VBUS: length 23.2
  Top Layer w0.406: USB.B4A9 42.4,9.13 v1(43.18,9.91)
  Top Layer w0.508: USB.A4B9 37.6,9.38 v1(36.82,10.16)
  Top Layer w0.762: v1(30.98,4.06) 32.74,4.06 D1.2
  Inner2 w0.762: v1(30.98,4.06) 30.98,6.86 34.28,10.16 v1(36.82,10.16) 37.59,10.92 42.16,10.92 v1(43.18,9.91)
ADC0: length 47.2
  Top Layer w0.254: v1(76.83,54.86) 73.15,58.55 58.66,58.55 42.08,41.97
  Bottom Layer w0.254: v1(76.83,54.86) 76,55.69
  Bottom Layer w0.406: R38.1 S1.2
ADC1: length 38
  Top Layer w0.254: v1(66.54,62.61) 62.01,62.61 U1.15
  Bottom Layer w0.254: v1(66.54,62.61) 66.54,61.54 R39.1
  Bottom Layer w0.406: R39.1 S2.2
ADC2: length 33.5
  Top Layer w0.254: v1(57.65,64.77) 57.65,58.96 U1.16
  Bottom Layer w0.254: v1(57.65,64.77) 56.23,64.77 R40.1
  Bottom Layer w0.406: R40.1 S3.2
ADC3: length 37.9
  Top Layer w0.254: v1(47.37,65.91) 48,66.55 49.78,66.55 51.3,65.02 51.3,53.47 43.81,45.97 43.05,45.97 39.75,42.67 U1.17
  Bottom Layer w0.254: v1(47.37,65.91) 46.09,65.91 R41.1
  Bottom Layer w0.406: R41.1 S4.2
ADC4: length 41.1
  Top Layer w0.254: 37.55,41.61 35.68,43.48 35.68,46.36 24.38,57.66 24.38,62.36 29.08,67.06 v1(33.01,67.06)
  Bottom Layer w0.254: v1(33.01,67.06) 33.01,66.98 R42.1
  Bottom Layer w0.406: S5.2 R42.1
ADC5: length 34.2
  Top Layer w0.254: v1(22.35,64.52) 22.35,58.8 35.17,45.97 35.17,43.28 U1.21
  Bottom Layer w0.254: R43.1 23.52,64.52 v1(22.35,64.52)
  Bottom Layer w0.406: S6.2 R43.1
ADC6: length 41
  Top Layer w0.254: v1(12.57,61.98) 12.57,59.06 14.47,57.15 23.24,57.15 34.67,45.72 34.67,43.08 U1.22
  Bottom Layer w0.254: v1(12.57,61.98) 13.02,61.98 R44.1 14,61.23
  Bottom Layer w0.406: S7.2 14,61.23
ADC7: length 47.2
  Top Layer w0.254: U1.23 34.16,42.89 34.16,45.21 23.24,56.13 5.2,56.13 v1(2.66,53.59)
  Bottom Layer w0.254: R45.1 3.41,53.59 v1(2.66,53.59)
  Bottom Layer w0.406: S8.2 R45.1
ADC8: length 37.2
  Top Layer w0.254: S10.1 32.8,56 R19.1 ; U1.25 37.33,38.3 v1(37.33,37.85)
  Bottom Layer w0.254: S10.1 27.05,56.9 24.63,54.48 24.63,48.89 34.92,38.61 36.57,38.61 v1(37.33,37.85)
ADC9: length 36.8
  Top Layer w0.254: R48.1 11,44.73 S9.1 ; v1(36.19,36.96) 36.19,38.73 35.43,39.49
  Bottom Layer w0.254: v1(36.19,36.96) 34.79,36.96 33.4,38.35 13.33,38.35 9.9,41.78 9.9,44.17 S9.1
ADC10: length 37.5
  Top Layer w0.254: R21.1 74,45 S12.1 ; 44.2,39.85 49.69,45.34 v1(50.67,45.34)
  Bottom Layer w0.254: S12.1 70.47,48.26 53.59,48.26 v1(50.67,45.34)
ADC11: length 20.7
  Top Layer w0.254: v1(50.92,48.39) 50.92,47.28 43.85,40.2 ; R20.1 49.9,53.9 S11.1
  Bottom Layer w0.254: v1(50.92,48.39) 50.92,54.08 S11.1
BOOT: length 44.9
  Top Layer w0.254: U1.60 47.6,30.86 50.92,30.86 53.78,28 R2.1 53.84,27.84 53.84,26.92 56,24.77 60.07,24.77 63.88,20.96 63.88,7.11 67.27,3.72 67.27,2
ENC_L_SCL: length 15.7
  Top Layer w0.254: U1.34 28.87,29.46 25.01,29.46 24,30.48 R8.1 21.27,31 left_encoder.3
ENC_L_SDA: length 13.8
  Top Layer w0.254: left_encoder.2 21.27,33 R7.1 23.87,33.13 23.87,33.91 24.51,34.54 33.24,34.54 U1.33
ENC_R_SCL: length 25.3
  Top Layer w0.254: U1.52 43.94,28.86 v1(43.94,28.19) ; R10.1 58.73,33 right_encoder.3
  Bottom Layer w0.254: v1(43.94,28.19) 43.94,31.24 46.48,33.78 58.49,33.78 right_encoder.3
ENC_R_SDA: length 27.1
  Top Layer w0.254: R9.1 58.73,31 right_encoder.2 ; v1(43.18,27.56) 43.18,28.92 U1.51
  Bottom Layer w0.254: v1(43.18,27.56) 44.44,27.56 44.7,27.81 44.7,30.99 46.99,33.27 56.46,33.27 right_encoder.2
IR_FL: length 29.4
  Top Layer w0.254: Q2.1 13.05,39 R53.1 15.01,38.99 23.11,38.99 v1(24.76,37.34) ; v1(34.92,30.1) 34.92,30.57 36.15,31.8
  Bottom Layer w0.254: v1(24.76,37.34) 25.14,37.72 26.16,37.72 26.66,37.21 26.66,35.05 31.62,30.1 v1(34.92,30.1)
IR_FR: length 32.5
  Top Layer w0.254: Q5.1 66.95,41 R59.1 65,42.94 58.54,49.4 v1(54.99,49.4) ; v1(48.38,46.99) 48.38,46.15 U1.11
  Bottom Layer w0.254: v1(54.99,49.4) 53.72,49.4 51.3,46.99 v1(48.38,46.99)
IR_L: length 23.6
  Top Layer w0.254: v1(36.44,46.99) 36.44,47.56 R55.1 36.05,48.05 Q3.1 ; v1(41.14,31.37) 42.14,31.37 U1.53
  Bottom Layer w0.254: v1(36.44,46.99) 35.3,45.85 35.3,43.43 38.86,39.88 38.86,34.42 41.14,32.13 v1(41.14,31.37)
IR_R: length 21.8
  Top Layer w0.254: v1(42.54,46.86) 42,47.4 R57.1 42.05,48.05 Q4.1 ; v1(41.91,32.89) 41.91,32.31 U1.54
  Bottom Layer w0.254: v1(42.54,46.86) 42.54,45.59 40.63,43.69 40.63,40.39 39.62,39.37 39.62,35.18 v1(41.91,32.89)
KEY0: length 31.4
  Top Layer w0.254: v1(18.92,49.15) 18.92,50.9 18.35,51.47 ; 36.14,40.2 38.09,38.24 v1(38.09,36.58)
  Bottom Layer w0.254: v1(18.92,49.15) 23.49,49.15 35.1,37.54 36.43,37.54 36.77,37.2 36.77,37.14 37.08,36.83 37.84,36.83 v1(38.09,36.58)
LE: length 32.7
  Top Layer w0.254: v1(32.51,28.32) 32.51,28.86 35.8,32.15 ; U10.5 U10.4 U10.3 26.03,10.54 v1(25.01,9.53)
  Bottom Layer w0.254: v1(25.01,9.53) 25.52,10.03 25.52,23.11 29.97,27.56 32.25,27.56 32.51,27.81 v1(32.51,28.32)
LED0: length 3.7
  Top Layer w0.254: R4.2 33,41.22 U1.27
LED1: length 5.8
  Top Layer w0.254: R5.2 30.98,41.98 30.98,40.77 31.24,40.51 33,40.51 U1.28
LED2: length 7.7
  Top Layer w0.254: R6.2 29.08,41.92 29.08,40.51 29.59,40 32.8,40 U1.29
LED_CONTROL: length 35.7
  Top Layer w0.254: U1.10 50.16,47.22 50.16,48.89 57.65,56.39 64.26,56.39 v1(67.56,53.09)
  Bottom Layer w0.254: v1(67.56,53.09) 67,53.64 ; 67,53.64 R13.2 ; 67,53.64 67,53.85 Q1.1
MLA: length 11.3
  Top Layer w0.406: U10.26 U10.9
  Top Layer w0.508: U10.26 21.76,13.2 left_motor.1
  Bottom Layer w0.406: left_motor.1 20.56,12 C86.2
MLB: length 10.8
  Top Layer w0.406: left_motor.2 25.16,15.04 U10.24 U10.11
  Bottom Layer w0.406: C87.2 21.02,15 left_motor.2
MLC: length 11.3
  Top Layer w0.406: U10.13 U10.22 21.84,16.8 left_motor.3
  Bottom Layer w0.406: C88.2 20.64,18 left_motor.3
MRA: length 11.3
  Top Layer w0.508: right_motor.1 58.26,13.2 U11.9 U11.26
  Bottom Layer w0.406: right_motor.1 61.54,12.46 C89.2
MRB: length 10.8
  Top Layer w0.508: right_motor.2 U11.11 U11.24
  Bottom Layer w0.406: C90.2 right_motor.2
MRC: length 11.3
  Top Layer w0.508: U11.22 U11.13 58.26,16.8 right_motor.3
  Bottom Layer w0.406: right_motor.3 61.54,17.54 C91.2
PLA: length 27
  Top Layer w0.254: v1(27.43,10.79) 27.97,11.34 U10.6 ; U1.37 29.97,28.44 v1(29.97,25.91)
  Bottom Layer w0.254: v1(27.43,10.79) 27.43,16.38 29.71,18.67 29.71,24.77 29.97,25.02 v1(29.97,25.91)
PLB: length 26.8
  Top Layer w0.254: v1(28.32,10.54) 28.62,10.85 U10.7 ; U1.38 30.86,28.62 v1(30.86,26.03)
  Bottom Layer w0.254: v1(28.32,10.54) 28.32,16.13 30.47,18.29 30.47,24.51 30.86,24.89 v1(30.86,26.03)
PLC: length 26.5
  Top Layer w0.254: U1.39 31.75,28.81 v1(31.75,26.03) ; U10.8 29.28,10.72 v1(29.46,10.54)
  Bottom Layer w0.254: v1(29.46,10.54) 29.46,11.05 28.95,11.56 28.95,15.88 31.3,18.22 31.3,24.45 31.75,24.89 v1(31.75,26.03)
PRA: length 29
  Top Layer w0.254: U11.6 53.97,10.67 v1(53.46,10.16) ; U1.58 45.59,31.46 45.59,30.48 v1(45.91,30.16)
  Bottom Layer w0.254: v1(45.91,30.16) 46.48,29.59 47.87,29.59 53.46,24 v1(53.46,10.16)
PRB: length 30.7
  Top Layer w0.254: U11.7 54.62,10.05 v1(54.35,9.78) ; U1.59 46.6,31.15 v1(46.6,30.73)
  Bottom Layer w0.254: v1(46.6,30.73) 46.99,30.35 47.87,30.35 55.24,22.99 55.24,18.92 54.35,18.03 v1(54.35,9.78)
PRC: length 30.3
  Top Layer w0.254: U11.8 55.28,10.51 v1(55.49,10.29) ; 45.61,33.55 46.65,32.51 v1(47.49,32.51)
  Bottom Layer w0.254: v1(55.49,10.29) 55.49,17.91 56.13,18.54 56.13,22.86 47.87,31.11 47.87,32.13 v1(47.49,32.51)
RE: length 38.9
  Top Layer w0.254: v1(51.94,23.11) 56.76,23.11 v1(57.02,23.37) ; 45.97,33.91 45.97,33.91 46.73,33.15 48.25,33.15 48.89,32.51 v1(48.89,32) ; v1(51.56,9.78) 52.03,10.25 U11.3 U11.4 U11.5
  Bottom Layer w0.254: v1(51.94,23.11) 51.68,23.11 51.56,22.99 v1(51.56,9.78) ; v1(57.02,23.37) 56.64,23.37 48.89,31.11 v1(48.89,32)
RESET: length 40.2
  Top Layer w0.254: C9.2 R1.1 53.92,38.92 53.92,37.64 54.1,37.47 56.71,37.47 57.47,38.23 57.47,40.46 57.65,40.64 58.64,40.64 DEBUG.4 ; C9.2 54,50.18 58.47,54.65 ; C9.2 52.33,42.67 47.73,42.67 U1.7
SCL: length 22.3
  Top Layer w0.254: v1(35.81,35.56) 34.67,34.42 34.63,34.42 34.13,33.92 34.03,33.92
  Bottom Layer w0.254: 39.62,23.88 40,23.5 U4.P$13 ; 39.62,23.88 39.62,28 39.69,28.08 39.69,28.56 39.62,28.64 39.62,31.75 v1(35.81,35.56) ; 39.62,23.88 37.33,23.88 36.06,22.61 36.06,22.06 R12.1
SCL_E: length 14
  Top Layer w0.254: U1.56 44.57,31.06 44.57,26.38 U14.1 46.1,24.85 46.1,23.75 46.6,23.24 48.64,23.24 50,24.61 R51.2
SDA: length 25.5
  Top Layer w0.254: 34.39,33.57 35.11,34.29 v1(35.94,34.29)
  Bottom Layer w0.254: v1(35.94,34.29) 35.05,35.18 35.05,35.81 35.56,36.32 36.06,36.32 40.13,32.26 40.13,24.26 40.5,23.88 40.5,22.85 ; 40.5,22.85 41.4,23.75 42.25,23.75 R11.1 ; 40.5,22.85 U4.P$14
SDA_E: length 12.6
  Top Layer w0.254: R52.2 49.22,27 48.64,26.42 48.64,25.59 U14.3 47.95,25.58 47.24,26.29 47.24,27.31 46.48,28.07 45.84,28.07 45.08,28.83 45.08,31.26 44.2,32.14
SWCLK: length 30.4
  Top Layer w0.254: v1(43.43,35.69) 40.38,32.64 40.38,30.3 U1.49 ; v1(58.03,41.4) 58.03,43.43 59.5,44.91 DEBUG.8
  Bottom Layer w0.254: v1(43.43,35.69) 49.65,41.91 57.53,41.91 v1(58.03,41.4)
SWDIO: length 29
  Top Layer w0.254: v1(42.54,36.19) 42.54,36.07 38.73,32.26 38.73,30.84 37.92,30.03
  Bottom Layer w0.254: DEBUG.6 60.29,43.56 59.3,43.56 58.29,42.55 48.89,42.55 v1(42.54,36.19)
SWO: length 23.6
  Top Layer w0.254: v1(44.7,36.07) 44.19,35.56 44.19,34.54 42.67,33.02 42.67,32.26 43.49,31.43
  Bottom Layer w0.254: v1(44.7,36.07) 48.64,40 59.28,40 DEBUG.2
UART_RX: length 43.4
  Top Layer w0.254: v1(41.91,36.83) 41.2,36.13 41.2,35.43 U1.43
  Bottom Layer w0.254: DEBUG.3 61.63,42.5 62.32,43.18 63.24,43.18 64.76,44.7 64.76,46.74 63.85,47.65 54.19,47.65 50.91,44.37 49.85,44.37 49.65,44.58 47.87,44.58 41.4,38.1 41.4,37.34 v1(41.91,36.83)
UART_TX: length 38.8
  Top Layer w0.254: U1.42 40.63,35.57 40.63,36.83 42,38.19 v1(42.44,38.19)
  Bottom Layer w0.254: v1(42.44,38.19) 47.3,43.05 54.35,43.05 58.16,46.86 62.61,46.86 64,45.47 64,44.7 63.11,43.81 61.81,43.81 DEBUG.5
USB_DN: length 31
  Top Layer w0.254: U1.44 36.27,29.79 36.2,29.79 36,29.59 v1(35.56,29.59) ; USB.A7 40.25,7.24 40,6.99 39.62,6.99 39.25,7.35 USB.B7 39.25,9.51 v1(39.24,9.53)
  Bottom Layer w0.254: v1(35.56,29.59) 35.56,29.34 34.16,27.94 34.16,12.32 35.43,11.05 38.09,11.05 39.24,9.91 v1(39.24,9.53)
USB_DP: length 29.5
  Top Layer w0.254: USB.B6 40.75,9.28 ; 40.75,9.28 40.51,9.53 40.13,9.53 39.75,9.15 USB.A6 ; 40.75,9.28 v1(40.75,9.65) ; v1(36.44,29.21) 36.44,29.26 37.57,30.39
  Bottom Layer w0.254: v1(36.44,29.21) 36.06,28.83 35.94,28.83 34.79,27.69 34.79,12.57 35.81,11.56 38.84,11.56 v1(40.75,9.65)
$1N1644: length 5.6
  Top Layer w0.305: U1.30 32.6,39.5 30.86,39.5 30,38.64 C8.1
$1N1647: length 13.5
  Top Layer w0.254: v1(39,53) 39.4,53.4 LED1.2 ; R4.1 33,44.85 v1(31.75,46.1)
  Bottom Layer w0.254: v1(31.75,46.1) 38.64,53 v1(39,53)
$1N1648: length 19
  Top Layer w0.254: v1(41.65,54.23) 41.07,53.65 LED1.3 ; v1(30.22,46.36) 31,45.58 R5.1
  Bottom Layer w0.254: v1(30.22,46.36) 38.48,54.61 41.27,54.61 v1(41.65,54.23)
$1N1649: length 19
  Top Layer w0.254: R6.1 29,46.4 v1(29.46,46.86) ; LED1.4 40.63,54.39 v1(40.63,55.5)
  Bottom Layer w0.254: v1(40.63,55.5) 38.09,55.5 v1(29.46,46.86)
$1N1777: length 10.7
  Top Layer w0.254: U1.6 48.06,42.29 50.67,42.29 50.85,42.11 50.85,41.15 C83.2 51,38.95 X1.1
$1N1778: length 7.6
  Top Layer w0.254: U1.5 45.84,39.37 46.86,39.37 47.87,38.35 47.87,37.34 48.06,37.15 X1.3 49,37.05 C82.2
$2N4501: length 2.1
  Top Layer w0.406: R22.1 4,44.73 LED11.1
$2N4505: length 2.9
  Top Layer w0.406: R23.1 37.9,60.1 LED12.1
$2N4506: length 2.4
  Top Layer w0.406: R24.1 43.1,61.1 LED13.1
$2N4507: length 2.1
  Top Layer w0.406: LED14.1 67,44.73 R25.1
$2N4532: length 2.5
  Bottom Layer w0.406: R14.1 LED3.1
$2N4534: length 2.5
  Bottom Layer w0.406: LED4.1 R15.1
$2N4536: length 2.5
  Bottom Layer w0.406: R16.1 LED5.1
$2N4538: length 2.5
  Bottom Layer w0.406: R17.1 LED6.1
$2N4540: length 2.5
  Bottom Layer w0.406: LED7.1 R18.1
$2N4542: length 2.5
  Bottom Layer w0.406: LED8.1 R26.1
$2N4544: length 2.5
  Bottom Layer w0.406: LED9.1 R27.1
$2N4546: length 2.5
  Bottom Layer w0.406: LED10.1 R28.1
$2N4634: length 102.2
  Bottom Layer w0.61: 70.75,59.29 70.75,56.53 69.72,55.5 66.6,55.5 Q1.3 ; 70.75,59.29 70.75,65.01 67.31,68.45 64.96,68.45 LED4.2 56.98,72.52 53.84,72.52 53,71.67 LED5.2 50.72,72.77 42.96,72.77 ; 70.75,59.29 72.2,59.29 LED3.2 ; 27.73,71.68 28.82,72.77 37,72.77 ; 27.73,71.68 27,70.95 LED8.2 ; 27.73,71.68 22.19,71.68 LED10.2 15.29,68.2 10.92,68.2 7,64.28 LED6.2 ; 37,72.77 37,72.77 LED7.2 ; 37,72.77 42.96,72.77 ; 42.96,72.77 43,72.73 LED9.2
$2N16121: length 10.6
  Top Layer w0.406: LED11.2 5.75,45 4.95,44.2 4.95,42.3 5.29,41.96 9.04,41.96 Q2.3
$2N16124: length 7
  Top Layer w0.406: LED14.2 70.99,43.28 70.99,41.15 69.84,40 Q5.3
$2N16127: length 8.9
  Top Layer w0.406: Q4.3 44.9,53.9 LED13.2
$2N16130: length 14.3
  Top Layer w0.406: Q3.3 37,56.09 33.4,59.69 33.4,60.83 34.46,61.9 LED12.2
$3N1283: length 3.8
  Top Layer w0.406: C13.1 23,19.62 U10.21
$3N1284: length 3.3
  Top Layer w0.406: C13.2 25.38,20.62 U10.20
$3N1285: length 3.8
  Top Layer w0.406: C14.2 31,19.62 U10.14
$3N1286: length 3.5
  Top Layer w0.406: 27.05,21 27.05,20.32 26.03,19.3 U10.19
$3N1323: length 5.5
  Top Layer w0.406: C19.1 47.67,20.67 47.67,19.26 48.13,18.8 49.83,18.8 U11.21
$3N1324: length 3.7
  Top Layer w0.406: U11.20 51.23,18.04 51.23,18.44 50,19.68 C19.2
$3N1325: length 3.4
  Top Layer w0.406: C20.2 56,18.62 U11.14
$3N1326: length 3.9
  Top Layer w0.406: U11.19 52.03,19.03 C21.2
$4N1009: length 3.6
  Top Layer w0.508: U12.6 41.95,16.95 C62.2
$4N1010: length 8.4
  Top Layer w0.508: C62.1 42.5,21 L1.1 40,18.5 40,16.64 40.64,16 U12.5
$4N1027: length 4.5
  Top Layer w0.254: R29.1 LED2.2
$4N1033: length 6.5
  Top Layer w0.254: USB.B5 41.75,9.68 v1(41.65,9.78)
  Bottom Layer w0.254: v1(41.65,9.78) 41.65,5.65 R30.1
$4N1034: length 6.5
  Top Layer w0.254: v1(38.48,9.78) 38.48,9.4 38.75,9.12 USB.A5
  Bottom Layer w0.254: R31.1 38.48,5.52 v1(38.48,9.78)

## Copper pours and planes (outline as drawn; the poured copper is in the pictures)
GND on Top Layer: -4.07,84.71 83.18,84.71 83.18,-2.67 -4.07,-2.67
GND on Bottom Layer: -6.1,87.88 86.23,87.88 86.23,-2.79 -6.1,-2.79
GND on Inner1: -6.61,82.68 84.58,82.68 84.58,-1.52 -6.61,-1.52

## Text on the board
Top Silkscreen Layer: + | GND
